# Altium schematic sheet mem.SchDoc
size A
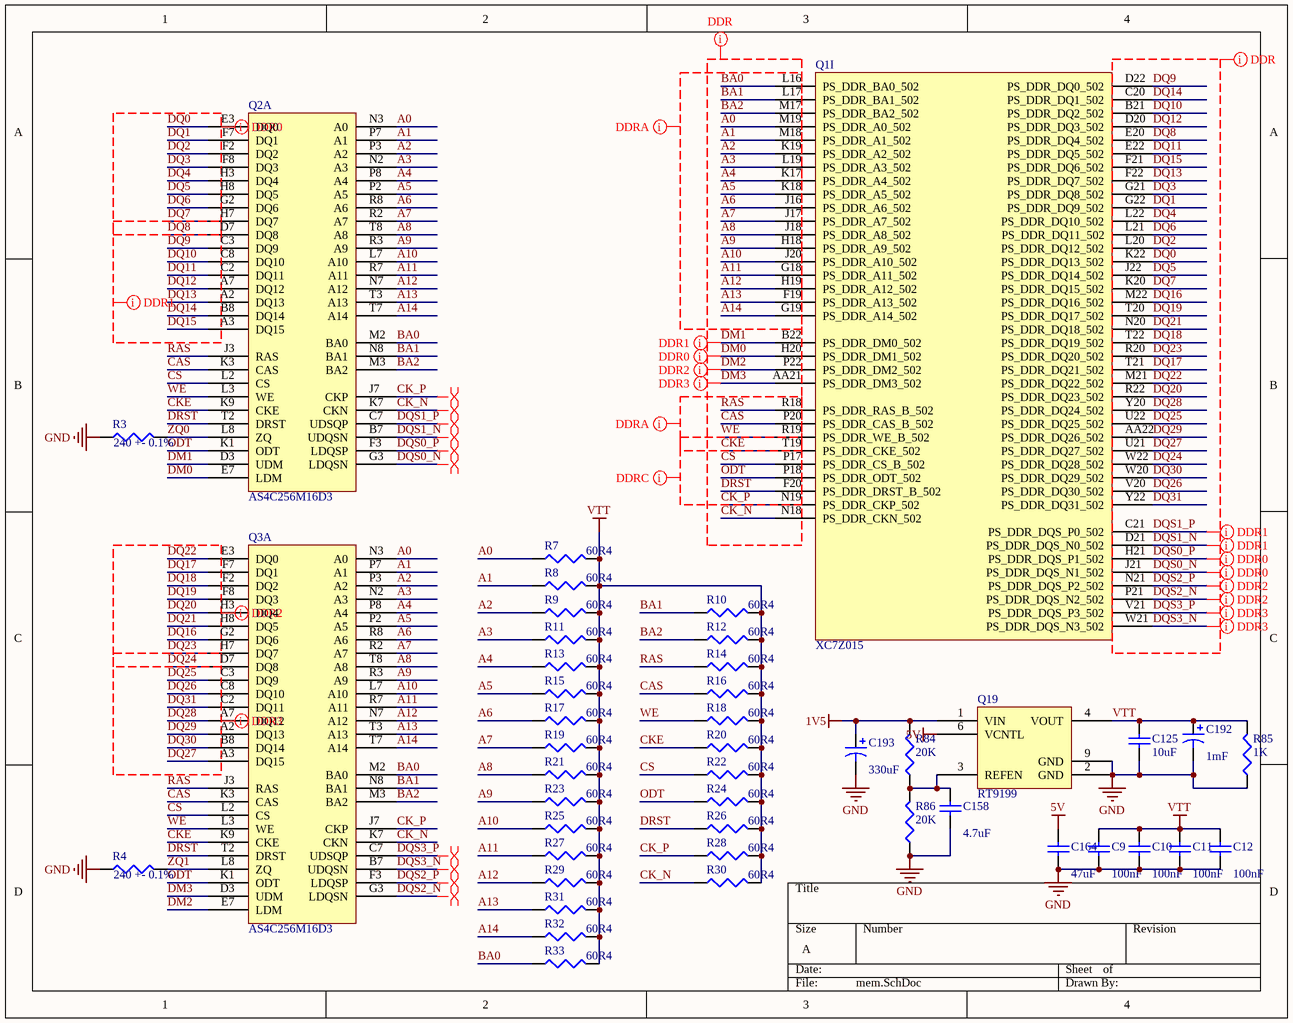
[diagram p0: mem.SchDoc]

## Parts
C9  value 100nF  [CAPC1005X06L]  (hidden comment: Cap)
C10  value 100nF  [CAPC1005X06L]  (hidden comment: Cap)
C11  value 100nF  [CAPC1005X06L]  (hidden comment: Cap)
C12  value 100nF  [CAPC1005X06L]  (hidden comment: Cap)
C125  value 10uF  [CAPC1608X90N]  (hidden comment: GRM188R60G106ME47)
C158  value 4.7uF  [CAPC1608X90N]  (hidden comment: GRM188R60J475ME19D)
C164  value 47uF  [CAPC3225X220N]  (hidden comment: GRM31CR60J476ME19L)
C192  value 1mF  [CAP-D/7343-31]  (hidden comment: TR3E108M004C0100)
C193  value 330uF  [CAP-D/7343-31]  (hidden comment: T520D337M006ATE018)
Q1  XC7Z015  [BGA484x22]  (part I of 9)
Q2  AS4C256M16D3  [DDR3]  (part A of 2)
Q3  AS4C256M16D3  [DDR3]  (part A of 2)
Q19  RT9199  [SOIC127P600X135_HS-9N]
R3  value 240 +- 0.1%  [J1-0603]  (hidden comment: RG1608P-241-B-T5)
R4  value 240 +- 0.1%  [J1-0603]  (hidden comment: RG1608P-241-B-T5)
R7  value 60R4  [CAPC1005X06L]  (hidden comment: RC1005F60R4CS)
R8  value 60R4  [CAPC1005X06L]  (hidden comment: RC1005F60R4CS)
R9  value 60R4  [CAPC1005X06L]  (hidden comment: RC1005F60R4CS)
R10  value 60R4  [CAPC1005X06L]  (hidden comment: RC1005F60R4CS)
R11  value 60R4  [CAPC1005X06L]  (hidden comment: RC1005F60R4CS)
R12  value 60R4  [CAPC1005X06L]  (hidden comment: RC1005F60R4CS)
R13  value 60R4  [CAPC1005X06L]  (hidden comment: RC1005F60R4CS)
R14  value 60R4  [CAPC1005X06L]  (hidden comment: RC1005F60R4CS)
R15  value 60R4  [CAPC1005X06L]  (hidden comment: RC1005F60R4CS)
R16  value 60R4  [CAPC1005X06L]  (hidden comment: RC1005F60R4CS)
R17  value 60R4  [CAPC1005X06L]  (hidden comment: RC1005F60R4CS)
R18  value 60R4  [CAPC1005X06L]  (hidden comment: RC1005F60R4CS)
R19  value 60R4  [CAPC1005X06L]  (hidden comment: RC1005F60R4CS)
R20  value 60R4  [CAPC1005X06L]  (hidden comment: RC1005F60R4CS)
R21  value 60R4  [CAPC1005X06L]  (hidden comment: RC1005F60R4CS)
R22  value 60R4  [CAPC1005X06L]  (hidden comment: RC1005F60R4CS)
R23  value 60R4  [CAPC1005X06L]  (hidden comment: RC1005F60R4CS)
R24  value 60R4  [CAPC1005X06L]  (hidden comment: RC1005F60R4CS)
R25  value 60R4  [CAPC1005X06L]  (hidden comment: RC1005F60R4CS)
R26  value 60R4  [CAPC1005X06L]  (hidden comment: RC1005F60R4CS)
R27  value 60R4  [CAPC1005X06L]  (hidden comment: RC1005F60R4CS)
R28  value 60R4  [CAPC1005X06L]  (hidden comment: RC1005F60R4CS)
R29  value 60R4  [CAPC1005X06L]  (hidden comment: RC1005F60R4CS)
R30  value 60R4  [CAPC1005X06L]  (hidden comment: RC1005F60R4CS)
R31  value 60R4  [CAPC1005X06L]  (hidden comment: RC1005F60R4CS)
R32  value 60R4  [CAPC1005X06L]  (hidden comment: RC1005F60R4CS)
R33  value 60R4  [CAPC1005X06L]  (hidden comment: RC1005F60R4CS)
R84  value 20K  [J1-0603]  (hidden comment: RC1608F203CS)
R85  value 1K  [J1-0603]  (hidden comment: RC1608J102CS)
R86  value 20K  [J1-0603]  (hidden comment: RC1608F203CS)

## Nets
1V5: C193.1 Q19.1(VIN) R84.2
5V: C164.2 Q19.6(VCNTL)
GND: C9.1 C10.1 C11.1 C12.1 C125.2 C158.1 C164.1 C192.2 C193.2 Q19.2(GND) Q19.9(GND) R3.1 R4.1 R85.1 R86.1
VTT: C9.2 C10.2 C11.2 C12.2 C125.1 C192.1 Q19.4(VOUT) R7.2 R8.2 R9.2 R10.2 R11.2 R12.2 R13.2 R14.2 R15.2 R16.2 R17.2 R18.2 R19.2 R20.2 R21.2 R22.2 R23.2 R24.2 R25.2 R26.2 R27.2 R28.2 R29.2 R30.2 R31.2 R32.2 R33.2 R85.2
A0: Q1.M19(PS_DDR_A0_502) Q2.N3(A0) Q3.N3(A0) R7.1
A1: Q1.M18(PS_DDR_A1_502) Q2.P7(A1) Q3.P7(A1) R8.1
A2: Q1.K19(PS_DDR_A2_502) Q2.P3(A2) Q3.P3(A2) R9.1
A3: Q1.L19(PS_DDR_A3_502) Q2.N2(A3) Q3.N2(A3) R11.1
A4: Q1.K17(PS_DDR_A4_502) Q2.P8(A4) Q3.P8(A4) R13.1
A5: Q1.K18(PS_DDR_A5_502) Q2.P2(A5) Q3.P2(A5) R15.1
A6: Q1.J16(PS_DDR_A6_502) Q2.R8(A6) Q3.R8(A6) R17.1
A7: Q1.J17(PS_DDR_A7_502) Q2.R2(A7) Q3.R2(A7) R19.1
A8: Q1.J18(PS_DDR_A8_502) Q2.T8(A8) Q3.T8(A8) R21.1
A9: Q1.H18(PS_DDR_A9_502) Q2.R3(A9) Q3.R3(A9) R23.1
A10: Q1.J20(PS_DDR_A10_502) Q2.L7(A10) Q3.L7(A10) R25.1
A11: Q1.G18(PS_DDR_A11_502) Q2.R7(A11) Q3.R7(A11) R27.1
A12: Q1.H19(PS_DDR_A12_502) Q2.N7(A12) Q3.N7(A12) R29.1
A13: Q1.F19(PS_DDR_A13_502) Q2.T3(A13) Q3.T3(A13) R31.1
A14: Q1.G19(PS_DDR_A14_502) Q2.T7(A14) Q3.T7(A14) R32.1
BA0: Q1.L16(PS_DDR_BA0_502) Q2.M2(BA0) Q3.M2(BA0) R33.1
BA1: Q1.L17(PS_DDR_BA1_502) Q2.N8(BA1) Q3.N8(BA1) R10.1
BA2: Q1.M17(PS_DDR_BA2_502) Q2.M3(BA2) Q3.M3(BA2) R12.1
CAS: Q1.P20(PS_DDR_CAS_B_502) Q2.K3(CAS) Q3.K3(CAS) R16.1
CK_N: Q1.N18(PS_DDR_CKN_502) Q2.K7(CKN) Q3.K7(CKN) R30.1
CK_P: Q1.N19(PS_DDR_CKP_502) Q2.J7(CKP) Q3.J7(CKP) R28.1
CKE: Q1.T19(PS_DDR_CKE_502) Q2.K9(CKE) Q3.K9(CKE) R20.1
CS: Q1.P17(PS_DDR_CS_B_502) Q2.L2(CS) Q3.L2(CS) R22.1
DM0: Q1.H20(PS_DDR_DM1_502) Q2.E7(LDM)
DM1: Q1.B22(PS_DDR_DM0_502) Q2.D3(UDM)
DM2: Q1.P22(PS_DDR_DM2_502) Q3.E7(LDM)
DM3: Q1.AA21(PS_DDR_DM3_502) Q3.D3(UDM)
DQ0: Q1.K22(PS_DDR_DQ13_502) Q2.E3(DQ0)
DQ1: Q1.G22(PS_DDR_DQ9_502) Q2.F7(DQ1)
DQ2: Q1.L20(PS_DDR_DQ12_502) Q2.F2(DQ2)
DQ3: Q1.G21(PS_DDR_DQ8_502) Q2.F8(DQ3)
DQ4: Q1.L22(PS_DDR_DQ10_502) Q2.H3(DQ4)
DQ5: Q1.J22(PS_DDR_DQ14_502) Q2.H8(DQ5)
DQ6: Q1.L21(PS_DDR_DQ11_502) Q2.G2(DQ6)
DQ7: Q1.K20(PS_DDR_DQ15_502) Q2.H7(DQ7)
DQ8: Q1.E20(PS_DDR_DQ4_502) Q2.D7(DQ8)
DQ9: Q1.D22(PS_DDR_DQ0_502) Q2.C3(DQ9)
DQ10: Q1.B21(PS_DDR_DQ2_502) Q2.C8(DQ10)
DQ11: Q1.E22(PS_DDR_DQ5_502) Q2.C2(DQ11)
DQ12: Q1.D20(PS_DDR_DQ3_502) Q2.A7(DQ12)
DQ13: Q1.F22(PS_DDR_DQ7_502) Q2.A2(DQ13)
DQ14: Q1.C20(PS_DDR_DQ1_502) Q2.B8(DQ14)
DQ15: Q1.F21(PS_DDR_DQ6_502) Q2.A3(DQ15)
DQ16: Q1.M22(PS_DDR_DQ16_502) Q3.G2(DQ6)
DQ17: Q1.T21(PS_DDR_DQ21_502) Q3.F7(DQ1)
DQ18: Q1.T22(PS_DDR_DQ19_502) Q3.F2(DQ2)
DQ19: Q1.T20(PS_DDR_DQ17_502) Q3.F8(DQ3)
DQ20: Q1.R22(PS_DDR_DQ23_502) Q3.H3(DQ4)
DQ21: Q1.N20(PS_DDR_DQ18_502) Q3.H8(DQ5)
DQ22: Q1.M21(PS_DDR_DQ22_502) Q3.E3(DQ0)
DQ23: Q1.R20(PS_DDR_DQ20_502) Q3.H7(DQ7)
DQ24: Q1.W22(PS_DDR_DQ28_502) Q3.D7(DQ8)
DQ25: Q1.U22(PS_DDR_DQ25_502) Q3.C3(DQ9)
DQ26: Q1.V20(PS_DDR_DQ30_502) Q3.C8(DQ10)
DQ27: Q1.U21(PS_DDR_DQ27_502) Q3.A3(DQ15)
DQ28: Q1.Y20(PS_DDR_DQ24_502) Q3.A7(DQ12)
DQ29: Q1.AA22(PS_DDR_DQ26_502) Q3.A2(DQ13)
DQ30: Q1.W20(PS_DDR_DQ29_502) Q3.B8(DQ14)
DQ31: Q1.Y22(PS_DDR_DQ31_502) Q3.C2(DQ11)
DQS0_N: Q1.J21(PS_DDR_DQS_N1_502) Q2.G3(LDQSN)
DQS0_P: Q1.H21(PS_DDR_DQS_P1_502) Q2.F3(LDQSP)
DQS1_N: Q1.D21(PS_DDR_DQS_N0_502) Q2.B7(UDQSN)
DQS1_P: Q1.C21(PS_DDR_DQS_P0_502) Q2.C7(UDSQP)
DQS2_N: Q1.P21(PS_DDR_DQS_N2_502) Q3.G3(LDQSN)
DQS2_P: Q1.N21(PS_DDR_DQS_P2_502) Q3.F3(LDQSP)
DQS3_N: Q1.W21(PS_DDR_DQS_N3_502) Q3.B7(UDQSN)
DQS3_P: Q1.V21(PS_DDR_DQS_P3_502) Q3.C7(UDSQP)
DRST: Q1.F20(PS_DDR_DRST_B_502) Q2.T2(DRST) Q3.T2(DRST) R26.1
ODT: Q1.P18(PS_DDR_ODT_502) Q2.K1(ODT) Q3.K1(ODT) R24.1
RAS: Q1.R18(PS_DDR_RAS_B_502) Q2.J3(RAS) Q3.J3(RAS) R14.1
WE: Q1.R19(PS_DDR_WE_B_502) Q2.L3(WE) Q3.L3(WE) R18.1
ZQ0: Q2.L8(ZQ) R3.2
ZQ1: Q3.L8(ZQ) R4.2
NetC158_2: C158.2 Q19.3(REFEN) R84.1 R86.2

## Layout directives
net class DDR: A0, A1, A2, A3, A4, A5, A6, A7, A8, A9, A10, A11, A12, A13, A14, BA0, BA1, BA2, CAS, CK_N, CK_P, CKE, CS, DM0, DM1, DM2, DM3, DQ0, DQ1, DQ2, DQ3, DQ4, DQ5, DQ6, DQ7, DQ8, DQ9, DQ10, DQ11, DQ12, DQ13, DQ14, DQ15, DQ16, DQ17, DQ18, DQ19, DQ20, DQ21, DQ22, DQ23, DQ24, DQ25, DQ26, DQ27, DQ28, DQ29, DQ30, DQ31, DQS0_N, DQS0_P, DQS1_N, DQS1_P, DQS2_N, DQS2_P, DQS3_N, DQS3_P, DRST, ODT, RAS, WE
differential pair: CK_N, CK_P, DQS0_N, DQS0_P, DQS1_N, DQS1_P, DQS2_N, DQS2_P, DQS3_N, DQS3_P
net class DDR0: DM0, DQ0, DQ1, DQ2, DQ3, DQ4, DQ5, DQ6, DQ7, DQ8, DQS0_N, DQS0_P
net class DDR3: DM3, DQ23, DQ24, DQ25, DQ26, DQ27, DQ28, DQ29, DQ30, DQ31, DQS3_N, DQS3_P
net class DDR2: DM2, DQ16, DQ17, DQ18, DQ19, DQ20, DQ21, DQ22, DQ23, DQ24, DQS2_N, DQS2_P
net class DDR1: DM1, DQ7, DQ8, DQ9, DQ10, DQ11, DQ12, DQ13, DQ14, DQ15, DQS1_N, DQS1_P
net class DDRA: A0, A1, A2, A3, A4, A5, A6, A7, A8, A9, A10, A11, A12, A13, A14, BA0, BA1, BA2, CAS, CKE, RAS, WE
net class DDRC: CK_P, CKE, CS, DRST, ODT, WE

## Library data of the parts
C9-C12 C125 C158 C164 = Cap: Capacitor; Published: 8-Jun-2000; LatestRevisionDate: 17-Jul-2002; LatestRevisionNote: Re-released for DXP Platform.; PackageReference: RAD-0.3; Publisher: Altium Limited; PackageDescription: Radial Cap, Thru-Hole; 2 Leads; 0.3 in Pin Spacing; Supplier 1: Digi-Key
  C9-C12: Supplier Part Number 1: 1276-1443-1-ND
  C125: Supplier Part Number 1: 490-3298-1-ND
  C158: Supplier Part Number 1: 490-5421-1-ND
  C164: Supplier Part Number 1: 490-3907-1-ND
C192 C193 = Cap Pol1: Polarized Capacitor (Radial); Published: 8-Jun-2000; LatestRevisionDate: 17-Jul-2002; LatestRevisionNote: Re-released for DXP Platform.; PackageReference: RB7.6-15; Publisher: Altium Limited; PackageDescription: Polarized Capacitor (Radial); 2 Leads; Supplier 1: Digi-Key
  C192: Supplier Part Number 1: 718-1452-1-ND
  C193: Supplier Part Number 1: 399-5149-1-ND
R3 R4 R7-R33 R84-R86 = Res3: Resistor; Published: 8-Jun-2000; LatestRevisionDate: 29-May-2009; LatestRevisionNote: IPC-7351 Footprint Added.; PackageReference: J1-0603; Publisher: Altium Limited; PackageDescription: Chip Resistor; Supplier 1: Digi-Key
  R3 R4: Supplier Part Number 1: RG16P240BCT-ND
  R7-R33: Supplier Part Number 1: 1276-3929-1-ND
  R84 R86: Supplier Part Number 1: 1276-4768-1-ND
  R85: Supplier Part Number 1: 1276-5062-1-ND
Q1 = XC7Z015: Supplier 1: Digi-Key; Supplier Part Number 1: 122-1905-ND
Q2 Q3 = AS4C256M16D3: Supplier 1: Digi-Key; Supplier Part Number 1: 1450-1095-ND
Q19 = RT9199: Supplier 1: Digi-Key; Supplier Part Number 1: 1028-1075-1-ND